# Altium project BT Mesh.PrjPcb
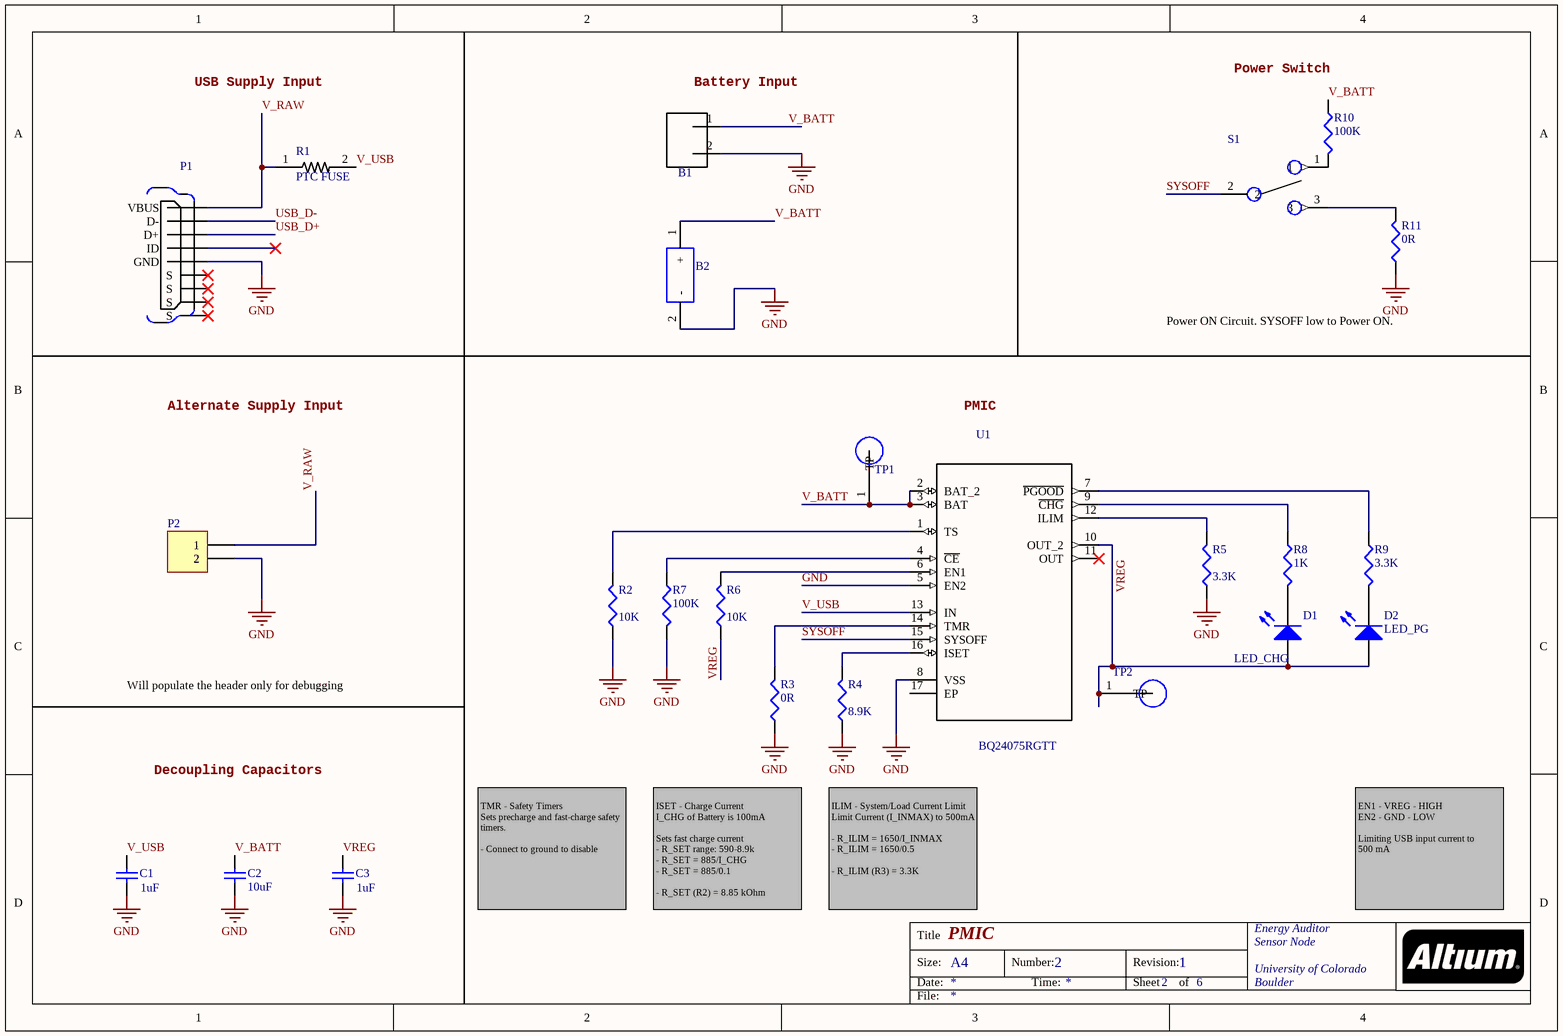
[diagram p0: PMIC.SchDoc]
6 sheets, 86 parts. Net scope: global (net labels, ports and power ports of the same name join across sheets).
Board file: BT Mesh.PcbDoc
Sheets:
  PMIC.SchDoc
  Regulator.SchDoc
  Gecko.SchDoc
  Gecko IO.SchDoc
  USB.SchDoc
  Block Diagram.SchDoc

## Sheet PMIC.SchDoc: PMIC
size A4; Organization: Energy Auditor; Address1: Sensor Node; Address3: University of Colorado; Address4: Boulder; DocumentNumber: 2; Revision: 1; SheetNumber: 2; SheetTotal: 6

### Parts
B1  S2B-PH-SM4-TB(LF)(SN)  [S2B-PH-SM4-TB(LF)(SN)]  (value not drawn)
B2  SMTU2450N-LF_BULK  [SMTU2430-LF]  (value not drawn)
C1  1uF  [1608[0603]]
C2  10uF  [1608[0603]]
C3  1uF  [1608[0603]]
D1  LED_CHG  [1608[0603]]
D2  LED_PG  [1608[0603]]
P1  10104111-0001LF  [FRAMATOME_10104111-0001LF]  (value not drawn)
P2  Header 2  [HDR1X2]  (value not drawn)
R1  PTC FUSE  [RESC3216X125N]
R2  10K  [1608[0603]]
R3  0R  [1608[0603]]
R4  8.9K  [1608[0603]]
R5  3.3K  [1608[0603]]
R6  10K  [1608[0603]]
R7  100K  [1608[0603]]
R8  1K  [1608[0603]]
R9  3.3K  [1608[0603]]
R10  100K  [1608[0603]]
R11  0R  [1608[0603]]
S1  AYZ0102AGRLC  [SW_AYZ0102AGRLC]  (value not drawn)
TP1  5019  [TP380X203]  (value not drawn)
TP2  5019  [TP380X203]  (value not drawn)
U1  BQ24075RGTT  [QFN50P300X300X100-17N]

### Nets
GND: B1.2 B2.2(-) C1.1 C2.1 C3.1 P1.5(GND) P2.2 R2.1 R3.1 R4.1 R5.1 R7.2 R11.1 U1.5(EN2) U1.8(VSS)
SYSOFF: S1.2 U1.15(SYSOFF)
USB_D+: P1.3(D+)
USB_D-: P1.2(D-)
V_BATT: B1.1 B2.1(+) C2.2 R10.1 TP1.1(TP) U1.2(BAT_2) U1.3(BAT)
V_RAW: P1.1(VBUS) P2.1 R1.1
V_USB: C1.2 R1.2 U1.13(IN)
VREG: C3.2 D1.1(A) D2.1(A) R6.1 TP2.1(TP) U1.10(OUT_2)
NetD1_2: D1.2(K) R8.2
NetD2_2: D2.2(K) R9.2
NetR2_2: R2.2 U1.1(TS)
NetR3_2: R3.2 U1.14(TMR)
NetR4_2: R4.2 U1.16(ISET)
NetR5_2: R5.2 U1.12(ILIM)
NetR6_2: R6.2 U1.6(EN1)
NetR7_1: R7.1 U1.4(~{CE})
NetR8_1: R8.1 U1.9(~{CHG})
NetR9_1: R9.1 U1.7(~{PGOOD})
NetR10_2: R10.2 S1.1
NetR11_2: R11.2 S1.3

Not connected (* = marked no-connect by the designer): P1 4(ID)* 6(S)* 7(S)* 8(S)* 9(S)*; U1 11(OUT)* 17(EP)

### Notes on the sheet
- USB Supply Input
- (near B1) Battery Input
- (near R10) Power Switch
- Power ON Circuit. SYSOFF low to Power ON.
- Alternate Supply Input
- PMIC
- Will populate the header only for debugging
- Decoupling Capacitors
- TMR - Safety Timers
  Sets precharge and fast-charge safety
  timers.
  - Connect to ground to disable
- ISET - Charge Current
  I_CHG of Battery is 100mA
  Sets fast charge current
  - R_SET range: 590-8.9k
  - R_SET = 885/I_CHG
  - R_SET = 885/0.1
  - R_SET (R2) = 8.85 kOhm
- ILIM - System/Load Current Limit
  Limit Current (I_INMAX) to 500mA
  - R_ILIM = 1650/I_INMAX
  - R_ILIM = 1650/0.5
  - R_ILIM (R3) = 3.3K
- EN1 - VREG - HIGH
  EN2 - GND - LOW
  Limiting USB input current to
  500 mA
- Title
- Size:
- Date:
- A4
- Number:
- Time:
- Revision:
- Sheet
- of
- File:

### Library data of the parts
B1 = S2B-PH-SM4-TB(LF)(SN): PH Series 2 Position 2 mm Pitch Surface Mount Side Entry Shrouded Header; Manufacturer: JST Sales America Inc.; Manufacturer Part Number: S2B-PH-SM4-TB(LF)(SN); Value: *; Digi-Key Part Number: 455-1749-1-ND; ComponentLInk1URL: https://www.digikey.com/products/en/connectors-interconnects/rectangular-connectors-headers-male-pins/314?k=S2B-PH-SM4-TB&k=&pkeyword=S2B-PH-SM4-TB&pv7=2&sf=0&quantity=&ColumnSort=0&page=1&pageSize=25; ComponentLink1Description: Digi-Key Link
B2 = SMTU2450N-LF_BULK: Coin Cell Battery Holders SFC MNT FOR CR2450N; Manufacturer: RENATA; Manufacturer Part Number: SMTU2450N-LF BULK; Mouser Part Number: 614-SMTU2450N-LF; ComponentLink1URL: https://www.mouser.com/ProductDetail/Renata/SMTU2450N-LF-BULK?qs=LsPilcdHE7Gn4SDnejz9jQ%3D%3D; ComponentLink1Description: Mouser Link
C1 C3 = Cap: CAP CER 1UF 16V X7R 0603; Manufacturer: Samsung Electro-Mechanics; Manufacturer Part Number: CL10B105MO8NNWC; Value: 1uF; Digi-Key Part Number: 1276-6524-1-ND; ComponentLink1URL: https://www.digikey.com/product-detail/en/samsung-electro-mechanics/CL10B105MO8NNWC/1276-6524-1-ND/5961383; ComponentLink1Description: Digi-Key Link
C2 = Cap Semi: CAP CER 10UF 10V X5R 0603; Manufacturer: Murata Electronics North America; Manufacturer Part Number: GRM188R61A106KE69D; Value: 10uF; Digi-Key Part Number: 490-10474-1-ND; ComponentLink1URL: https://www.digikey.com/products/en?keywords=490-10474-1-ND; ComponentLink1Description: Digi-Key Link
D1 = LED2: Blue 470nm LED Indication - Discrete 2.85V 0603 (1608 Metric); Manufacturer: OSRAM Opto Semiconductors Inc.; Manufacturer Part Number: LB Q39G-L2OO-35-1; Digi-Key Part Number: 475-2816-1-ND; ComponentLink1URL: https://www.digikey.com/product-detail/en/osram-opto-semiconductors-inc/LB-Q39G-L2OO-35-1/475-2816-1-ND/2176355; ComponentLink1Description: Digi-Key Link
D2 = LED2: LED GREEN DIFFUSED 0603 SMD; Manufacturer: OSRAM Opto Semiconductors Inc.; Manufacturer Part Number: LG L29K-F2J1-24-Z; Digi-Key Part Number: 475-3118-1-ND; ComponentLink1URL: https://www.digikey.com/product-detail/en/osram-opto-semiconductors-inc/LG-L29K-F2J1-24-Z/475-3118-1-ND/4899549; ComponentLink1Description: Digi-Key Link
P1 = 10104111-0001LF: Micro Usb, 2.0 Type Ab, Receptacle, Th; Manufacturer: Amphenol FCI; Digi-Key Part Number: 609-4053-1-ND; ComponentLink1URL: https://www.digikey.com/product-detail/en/amphenol-fci/10104111-0001LF/609-4053-1-ND/2350359?utm_source=snapeda&utm_medium=aggregator&utm_campaign=symbol; Manufacturer Part Number: 10104111-0001LF; Value: *; ComponentLink1Description: Digi-Key Link
P2 = Header 2: Header, 2-Pin
R1 = 0ZCA0075FF2G: PTC RESET FUSE 6V 500MA 1206; Manufacturer: Bel Fuse; Manufacturer Part Number: Littelfuse Inc.; Value: *; Digi-Key Part Number: F2112CT-ND; ComponentLink1URL: https://www.digikey.com/product-detail/en/littelfuse-inc/1206L050YR/F2112CT-ND/455721; ComponentLink1Description: Digi-Key Link
R2 R6 = Res3: RES SMD 10K OHM 1% 1/8W 0603; Manufacturer: Vishay Beyschlag; Manufacturer Part Number: MCT06030C1002FP500; Value: 10K; Digi-Key Part Number: MCT0603-10.0K-CFCT-ND; ComponentLink1URL: https://www.digikey.com/products/en?keywords=MCT0603-10.0K-CFCT-ND; ComponentLink1Description: Digi-Key Link
R3 R11 = Res3: RES 0 OHM JUMPER 1/8W 0603; Manufacturer: Vishay Beyschlag; Manufacturer Part Number: MCT0603MZ0000ZP500; Value: 0R; Digi-Key Part Number: 749-1745-1-ND; ComponentLink1URL: https://www.digikey.com/product-detail/en/vishay-beyschlag/MCT0603MZ0000ZP500/749-1745-1-ND/7348053; ComponentLink1Description: Digi-Key Link
R4 = Res3: RES SMD 8.87KOHM 0.5% 1/10W 0603; Manufacturer: Yageo; Manufacturer Part Number: RT0603DRD078K87L; Value: 8.9K; Digi-Key Part Number: 311-8.87KDCT-ND; ComponentLink1URL: https://www.digikey.com/product-detail/en/yageo/RT0603DRD078K87L/311-8.87KDCT-ND/1035893; ComponentLink1Description: Digi-Key Link
R5 R9 = Res3: RES SMD 3.3K OHM 5% 1/10W 0603; Manufacturer: Panasonic Electronic Components; Manufacturer Part Number: ERJ-3GEYJ332V; Value: 3.3K; Digi-Key Part Number: P3.3KGCT-ND; ComponentLink1URL: https://www.digikey.com/product-detail/en/panasonic-electronic-components/ERJ-3GEYJ332V/P3.3KGCT-ND/135146; ComponentLink1Description: Digi-Key Link
R7 R10 = Res3: RES SMD 100K OHM 0.1% 1/10W 0603; Manufacturer: Susumu; Manufacturer Part Number: RG1608P-104-B-T5; Value: 100K; Digi-Key Part Number: RG16P100KBCT-ND; ComponentLink1URL: https://www.digikey.com/products/en/resistors/chip-resistor-surface-mount/52?k=RG1608P-104-B-T5&k=&pkeyword=RG1608P-104-B-T5&pv7=2&sf=0&quantity=&ColumnSort=0&page=1&pageSize=25; ComponentLink1Description: Digi-Key Link
R8 = Res3: RES SMD 1K OHM 0.1% 1/10W 0603; Manufacturer: Yageo; Manufacturer Part Number: RT0603BRD071KL; Value: 1K; Digi-Key Part Number: YAG1237CT-ND; ComponentLink1URL: https://www.digikey.com/product-detail/en/yageo/RT0603BRD071KL/YAG1237CT-ND/4340590; ComponentLink1Description: Digi-Key Link
S1 = AYZ0102AGRLC: SWITCH SLIDE SPDT 100MA 12V; Manufacturer: C&K; Digi-Key Part Number: 401-2012-1-ND; Manufacturer Part Number: AYZ0102AGRLC; ComponentLink1URL: https://www.digikey.com/products/en/switches/slide-switches/213?k=AYZ0102AGRLC&k=&pkeyword=AYZ0102AGRLC&pv7=2&sf=0&quantity=&ColumnSort=0&page=1&pageSize=25; ComponentLink1Description: Digi-Key Link
TP1 TP2 = 5019: Phosphor Bronze Contact Miniature Silver Plated Surface Mount Test Points; Manufacturer: Keystone; Manufacturer Part Number: 5019; Digi-Key Part Number: 36-5019CT-ND; ComponentLink1URL: https://www.digikey.com/product-detail/en/keystone-electronics/5019/36-5019CT-ND/3907344?utm_source=snapeda&utm_medium=aggregator&utm_campaign=symbol; Value: *; ComponentLink1Description: Digi-Key Link
U1 = BQ24075RGTT: USB-Friendly Li-Ion Battery Charger and Power-Path Management IC, Vout 5.5V 16-QFN -40 to 85; Manufacturer: Texas Instruments; Manfacturer Part Number: BQ24075RGTT; Availability: Unavailable; Value: *; Digi-Key Part Number: 296-38874-1-ND; ComponentLink1Description: Digi-Key Link; ComponentLink1URL: https://www.digikey.com/products/en/integrated-circuits-ics/pmic-battery-chargers/781?k=BQ24075RGTR&k=&pkeyword=BQ24075RGTR&pv7=2&sf=0&quantity=&ColumnSort=0&page=1&pageSize=25

## Sheet Regulator.SchDoc: Regulator
size A4; Organization: Energy Auditor; Address1: Sensor Node; Address3: University of Colorado; Address4: Boulder; DocumentNumber: 3; Revision: 1; SheetNumber: 3; SheetTotal: 6
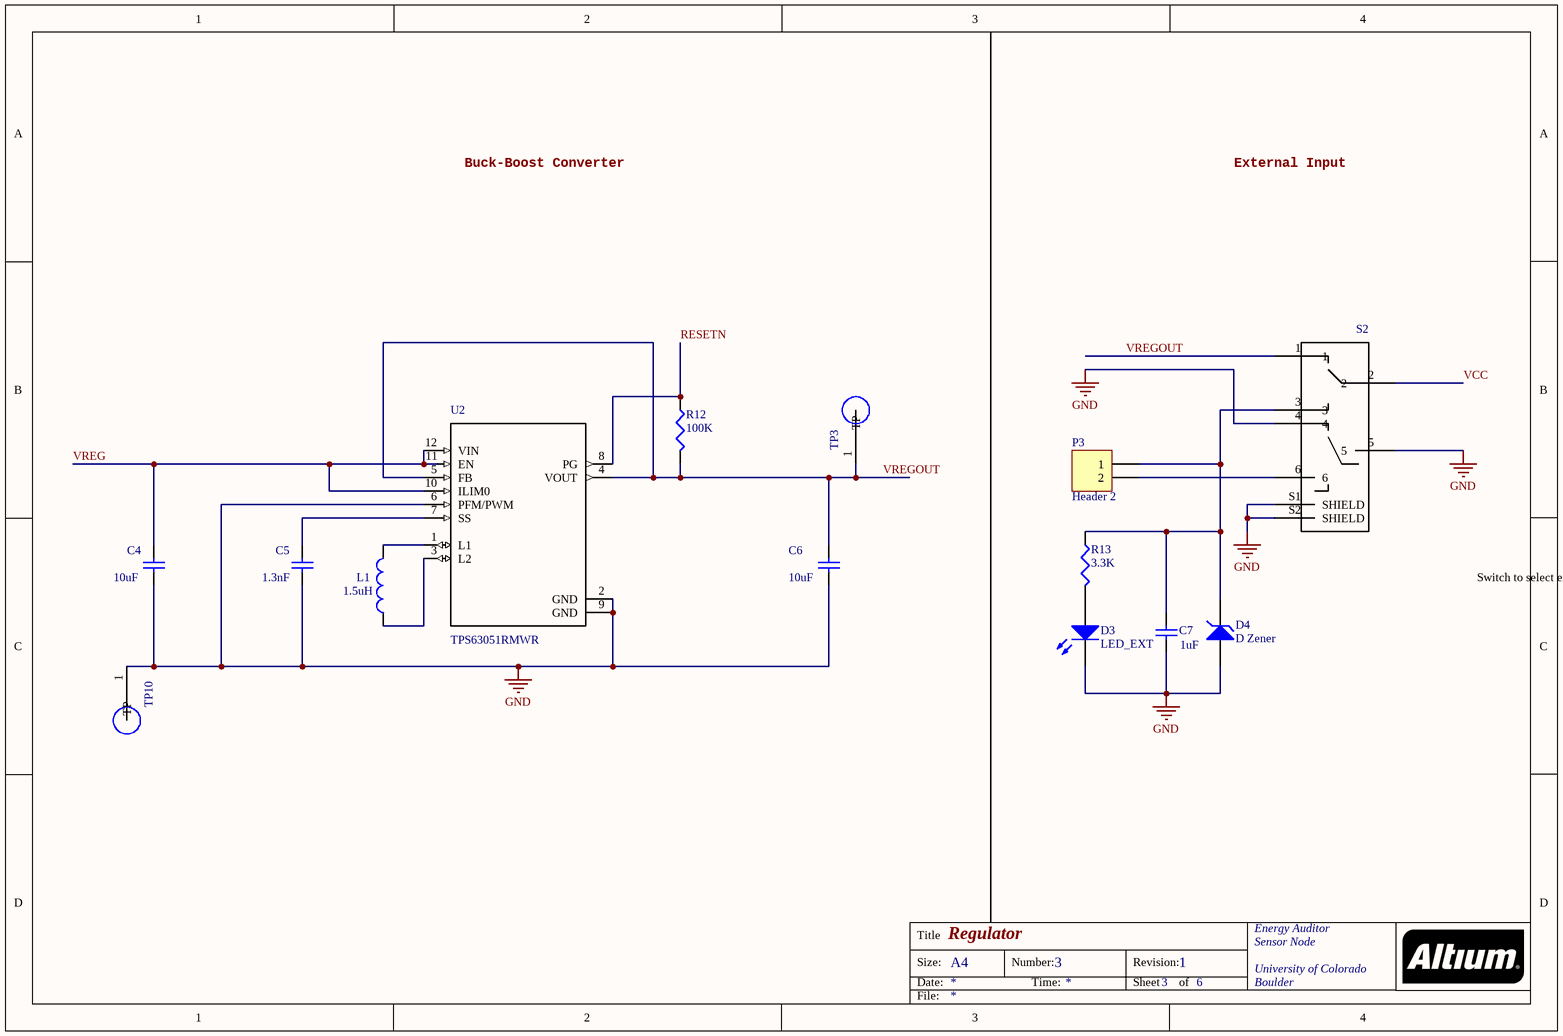
[diagram p1: Regulator.SchDoc]

### Parts
C4  10uF  [1608[0603]]
C5  1.3nF  [1608[0603]]
C6  10uF  [1608[0603]]
C7  1uF  [1608[0603]]
D3  LED_EXT  [3.2X1.6X1.1]
D4  D Zener  [0402]
L1  1.5uH  [0603]
P3  Header 2  [HDR1X2]
R12  100K  [1608[0603]]
R13  3.3K  [1608[0603]]
S2  1825289-1  [SW_1825289-1_1825289-1(Primary)]  (value not drawn)
TP3  5019  [TP380X203]  (value not drawn)
TP10  5019  [TP380X203]  (value not drawn)
U2  TPS63051RMWR  [QFN50P250X250X100-12N]

### Nets
GND: C4.1 C5.1 C6.1 C7.1 D3.2(K) D4.1(A) S2.4 S2.5 S2.S1(SHIELD) S2.S2(SHIELD) TP10.1(TP) U2.2(GND) U2.6(PFM/PWM) U2.9(GND)
RESETN: R12.1 U2.8(PG)
VCC: S2.2
VREG: C4.2 U2.10(ILIM0) U2.11(EN) U2.12(VIN)
VREGOUT: C6.2 R12.2 S2.1 TP3.1(TP) U2.4(VOUT) U2.5(FB)
NetC5_2: C5.2 U2.7(SS)
NetC7_2: C7.2 D4.2(K) P3.1 R13.2 S2.3
NetD3_1: D3.1(A) R13.1
NetL1_1: L1.1 U2.3(L2)
NetL1_2: L1.2 U2.1(L1)
NetP3_2: P3.2 S2.6

### Notes on the sheet
- Buck-Boost Converter
- External Input
- Switch to select external supply
- Title
- Size:
- Date:
- A4
- Number:
- Time:
- Revision:
- Sheet
- of
- File:

### Library data of the parts
C4 C6 = Cap: CAP CER 10UF 10V X5R 0603; Manufacturer: Murata Electronics North America; Manufacturer Part Number: GRM188R61A106KE69D; Value: 10uF; ComponentLink1URL: https://www.digikey.com/products/en?keywords=490-10474-1-ND; ComponentLink1Description: Digi-Key Link; Digi-Key Part Number: 490-10474-1-ND
C5 = Cap: CAP CER 1300PF 25V C0G/NP0 0603; Manufacturer: KEMET; Manufacturer Part Number: C0603C132J3GAC7867; Value: 1.3nF; ComponentLink1URL: https://www.digikey.com/product-detail/en/kemet/C0603C132J3GAC7867/399-14953-1-ND/7382502; ComponentLink1Description: Digi-Key Link; Digi-Key Part Number: 399-14953-1-ND
C7 = Cap: as C1 on sheet PMIC; Value: 1uF; Digi-Key Part Number: 1276-6524-1-ND; ComponentLink1URL: https://www.digikey.com/product-detail/en/samsung-electro-mechanics/CL10B105MO8NNWC/1276-6524-1-ND/5961383; ComponentLink1Description: Digi-Key Link
D3 = LED2: as D2 on sheet PMIC; Digi-Key Part Number: 475-3118-1-ND; ComponentLink1URL: https://www.digikey.com/product-detail/en/osram-opto-semiconductors-inc/LG-L29K-F2J1-24-Z/475-3118-1-ND/4899549; ComponentLink1Description: Digi-Key Link
D4 = D Zener: TVS DIODE 5.5V 14V 2X1SON; Manufacturer Part Number: TPD1E10B06DPYR; Manufacturer: Texas Instruments; ComponentLink1URL: https://www.digikey.com/product-detail/en/texas-instruments/TPD1E10B06DPYR/296-30406-1-ND/3283560; ComponentLink1Description: Digi-Key Link; Value: *; Digi-Key Part Number: 296-30406-1-ND
L1 = Inductor: FIXED IND 1.5UH 1.1A 213 MOHM; Manufacturer: Murata Electronics North America; Manufacturer Part Number: LQM18PN1R5MFHD; Value: 1.5uH; Digi-Key Part Number: 490-15637-1-ND; ComponentLink1URL: https://www.digikey.com/product-detail/en/murata-electronics-north-america/LQM18PN1R5MFHD/490-15637-1-ND/6800302; ComponentLink1Description: Digi-Key Link
P3 = Header 2: Header, 2-Pin
R12 = Res3: as R7 on sheet PMIC; Value: 100K; Digi-Key Part Number: RG16P100KBCT-ND; ComponentLink1URL: https://www.digikey.com/products/en/resistors/chip-resistor-surface-mount/52?k=RG1608P-104-B-T5&k=&pkeyword=RG1608P-104-B-T5&pv7=2&sf=0&quantity=&ColumnSort=0&page=1&pageSize=25; ComponentLink1Description: Digi-Key Link
R13 = Res3: as R5 on sheet PMIC; Value: 3.3K; Digi-Key Part Number: P3.3KGCT-ND; ComponentLink1URL: https://www.digikey.com/product-detail/en/panasonic-electronic-components/ERJ-3GEYJ332V/P3.3KGCT-ND/135146; ComponentLink1Description: Digi-Key Link
S2 = 1825289-1: MHS22204=DPDT SL SW VERT AG; Manufacturer: TE Connectivity; Manufacturer Part Number: 1825289-1; ComponentLink1URL: https://www.digikey.com/products/en?keywords=MHS22204; ComponentLink1Description: Digi-Key Link; Digi-Key Part Number: 450-1572-ND
TP3 TP10 = 5019: as TP1 on sheet PMIC; Manufacturer Part Number: 5019; Digi-Key Part Number: 36-5019CT-ND; ComponentLink1URL: https://www.digikey.com/product-detail/en/keystone-electronics/5019/36-5019CT-ND/3907344?utm_source=snapeda&utm_medium=aggregator&utm_campaign=symbol; Value: *; ComponentLink1Description: Digi-Key Link
U2 = TPS63051RMWR: Tiny Single Inductor Buck Boost Converter 12-VQFN -40 to 85; Manufacturer: Texas Instruments; Manufacturer Part Number: TPS63051RMWR; Value: *; Digi-Key Part Number: 296-42650-1-ND; ComponentLink1URL: https://www.digikey.com/products/en/integrated-circuits-ics/pmic-voltage-regulators-dc-dc-switching-regulators/739?k=TPS63051RMWR&k=&pkeyword=TPS63051RMWR&pv7=2&sf=0&quantity=&ColumnSort=0&page=1&pageSize=25; ComponentLink1Description: Digi-Key Link

## Sheet Gecko.SchDoc: Blue Gecko and Sensor
size A4; Organization: Energy Auditor; Address1: Sensor Node; Address3: University of Colorado; Address4: Boulder; DocumentNumber: 4; Revision: 1; SheetNumber: 4; SheetTotal: 6
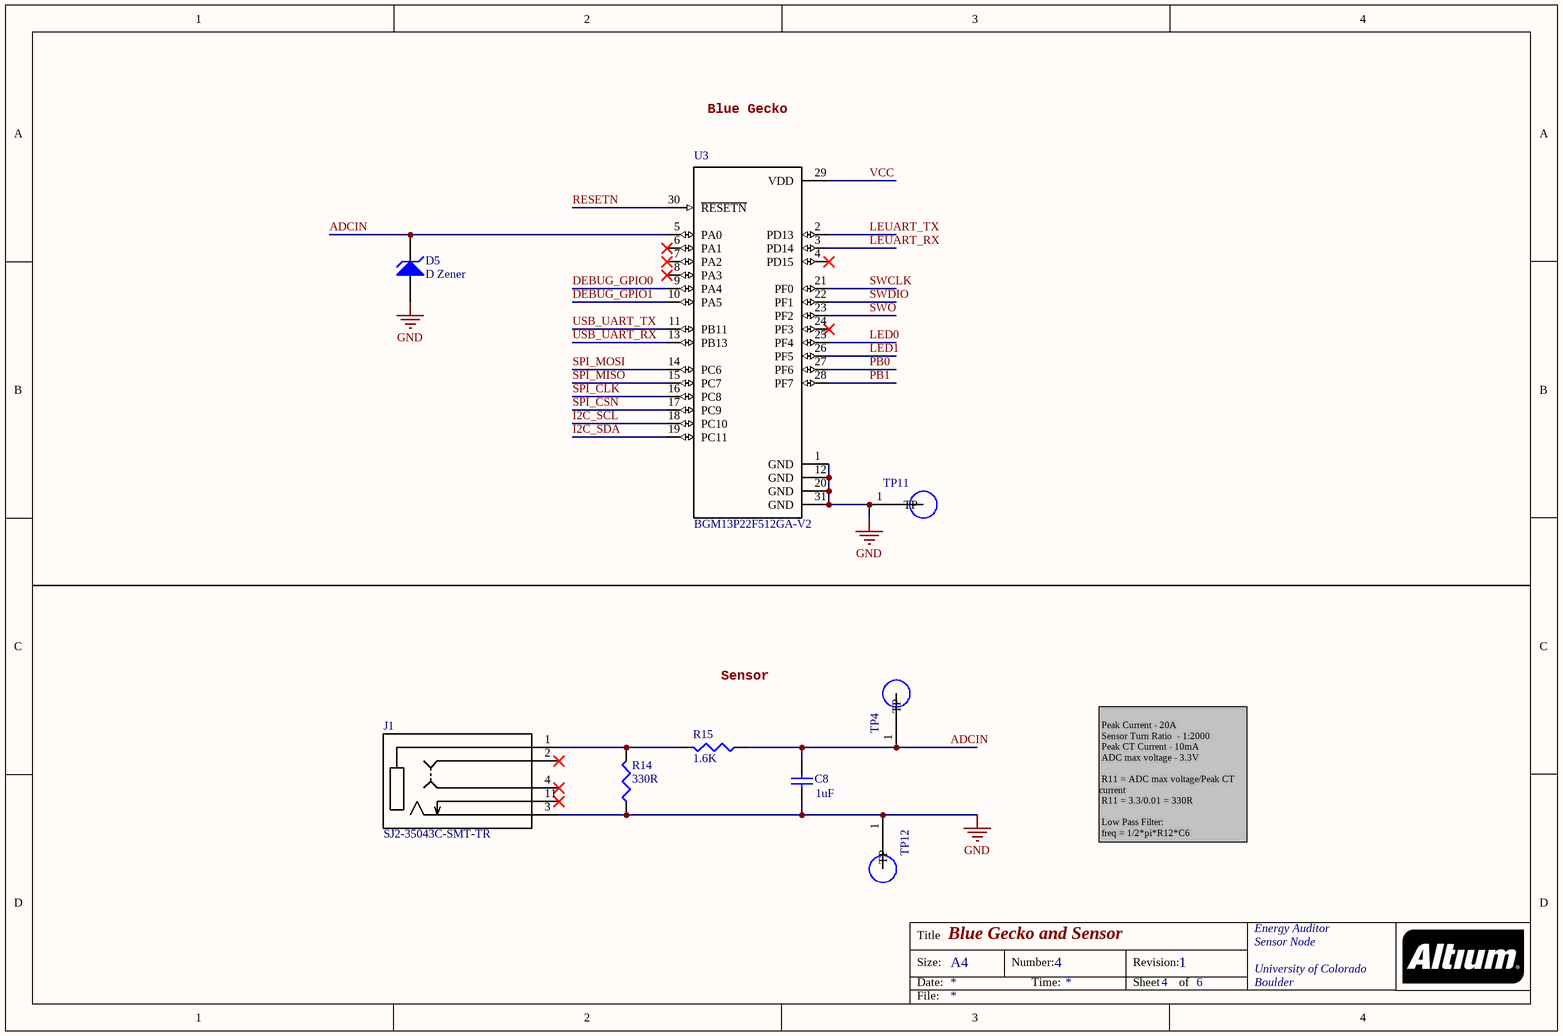
[diagram p2: Gecko.SchDoc]

### Parts
C8  1uF  [1608[0603]]
D5  D Zener  [0402]
J1  SJ2-35043C-SMT-TR  [CUI_SJ2-35043C-SMT-TR]
R14  value 330R  [1608[0603]]  (hidden comment: 330)
R15  1.6K  [1608[0603]]
TP4  5019  [TP380X203]  (value not drawn)
TP11  5019  [TP380X203]  (value not drawn)
TP12  5019  [TP380X203]  (value not drawn)
U3  BGM13P22F512GA-V2  [MODULE_BGM13P22F512GA-V2]

### Nets
GND: C8.1 D5.1(A) J1.3(RING) R14.1 TP11.1(TP) TP12.1(TP) U3.1(GND) U3.12(GND) U3.20(GND) U3.31(GND)
ADCIN: C8.2 D5.2(K) R15.1 TP4.1(TP) U3.5(PA0)
DEBUG_GPIO0: U3.9(PA4)
DEBUG_GPIO1: U3.10(PA5)
I2C_SCL: U3.18(PC10)
I2C_SDA: U3.19(PC11)
LED0: U3.25(PF4)
LED1: U3.26(PF5)
LEUART_RX: U3.3(PD14)
LEUART_TX: U3.2(PD13)
PB0: U3.27(PF6)
PB1: U3.28(PF7)
RESETN: U3.30(~{RESETN})
SPI_CLK: U3.16(PC8)
SPI_CSN: U3.17(PC9)
SPI_MISO: U3.15(PC7)
SPI_MOSI: U3.14(PC6)
SWCLK: U3.21(PF0)
SWDIO: U3.22(PF1)
SWO: U3.23(PF2)
USB_UART_RX: U3.13(PB13)
USB_UART_TX: U3.11(PB11)
VCC: U3.29(VDD)
NetJ1_1: J1.1(SLEEVE) R14.2 R15.2

Not connected (* = marked no-connect by the designer): J1 2(TIP_1)* 4(TIP_2)* 11(RING_SWITCH)*; U3 4(PD15)* 6(PA1)* 7(PA2)* 8(PA3)* 24(PF3)*

### Notes on the sheet
- Blue Gecko
- Sensor
- Peak Current - 20A
  Sensor Turn Ratio  - 1:2000
  Peak CT Current - 10mA
  ADC max voltage - 3.3V
  R11 = ADC max voltage/Peak CT current
  R11 = 3.3/0.01 = 330R
  Low Pass Filter:
  freq = 1/2*pi*R12*C6
  freq = 312 Hz
- Title
- Size:
- Date:
- A4
- Number:
- Time:
- Revision:
- Sheet
- of
- File:

### Library data of the parts
C8 = Cap: as C1 on sheet PMIC; Value: 1uF; Digi-Key Part Number: 1276-6524-1-ND; ComponentLink1URL: https://www.digikey.com/product-detail/en/samsung-electro-mechanics/CL10B105MO8NNWC/1276-6524-1-ND/5961383; ComponentLink1Description: Digi-Key Link
D5 = D Zener: Zener Diode; Manufacturer Part Number: TPD1E10B06DPYR; Manufacturer: Texas Instruments; ComponentLink1URL: https://www.digikey.com/product-detail/en/texas-instruments/TPD1E10B06DPYR/296-30406-1-ND/3283560; ComponentLink1Description: Digi-Key Link; Value: *; Digi-Key Part Number: 296-30406-1-ND
J1 = SJ2-35043C-SMT-TR: AUDIO JACK, 3.5 MM, RT, 4 CONDUC; Manufacturer: CUI Inc.; Value: *; Digi-Key Part Number: CP-SJ2-35043C-SMT-CT-ND; Manufacturer Part Number: SJ2-35043C-SMT-TR; ComponentLink1URL: https://www.digikey.com/products/en/connectors-interconnects/barrel-audio-connectors/434?k=SJ2-35043C-SMT-TR&k=&pkeyword=SJ2-35043C-SMT-TR&pv7=2&sf=0&quantity=&ColumnSort=0&page=1&pageSize=25; ComponentLink1Description: Digi-Key Link
R14 = Res3: RES SMD 330 OHM 5% 1/10W 0603; Manufacturer: Vishay Dale; Manufacturer Part Number: CRCW0603330RJNEAC; Digi-Key Part Number: 541-4060-1-ND; ComponentLink1URL: https://www.digikey.com/product-detail/en/vishay-dale/CRCW0603330RJNEAC/541-4060-1-ND/7928743; ComponentLink1Description: Digi-Key Link
R15 = Res3: RES SMD 1.6K OHM 5% 1/10W 0603; Manufacturer: Yageo; Manufacturer Part Number: RC0603JR-071K6L; Value: 1.6K; Digi-Key Part Number: 311-1.6KGRCT-ND; ComponentLink1URL: https://www.digikey.com/product-detail/en/yageo/RC0603JR-071K6L/311-1.6KGRCT-ND/729639; ComponentLink1Description: Digi-Key Link
TP4 TP11 TP12 = 5019: as TP1 on sheet PMIC; Manufacturer Part Number: 5019; Digi-Key Part Number: 36-5019CT-ND; ComponentLink1URL: https://www.digikey.com/product-detail/en/keystone-electronics/5019/36-5019CT-ND/3907344?utm_source=snapeda&utm_medium=aggregator&utm_campaign=symbol; Value: *; ComponentLink1Description: Digi-Key Link
U3 = BGM13P22F512GA-V2: BLUETOOTH 5.0 MODULE; Manufacturer: Silicon Labs; Manufacturer Part Number: BGM13P22F512GA-V2; Value: *; ComponentLink1URL: https://www.digikey.com/products/en/rf-if-and-rfid/rf-transceiver-modules/872?k=BGM13P22F512GA-V2&k=&pkeyword=BGM13P22F512GA-V2&pv7=2&sf=0&quantity=&ColumnSort=0&page=1&pageSize=25; ComponentLink1Description: Digi-Key Link; Digi-Key Part Number: 336-5146-1-ND

## Sheet Gecko IO.SchDoc: Gecko IO
size A4; Organization: Energy Auditor; Address1: Sensor Node; Address3: University of Colorado; Address4: Boulder; DocumentNumber: 5; Revision: 1; SheetNumber: 5; SheetTotal: 6
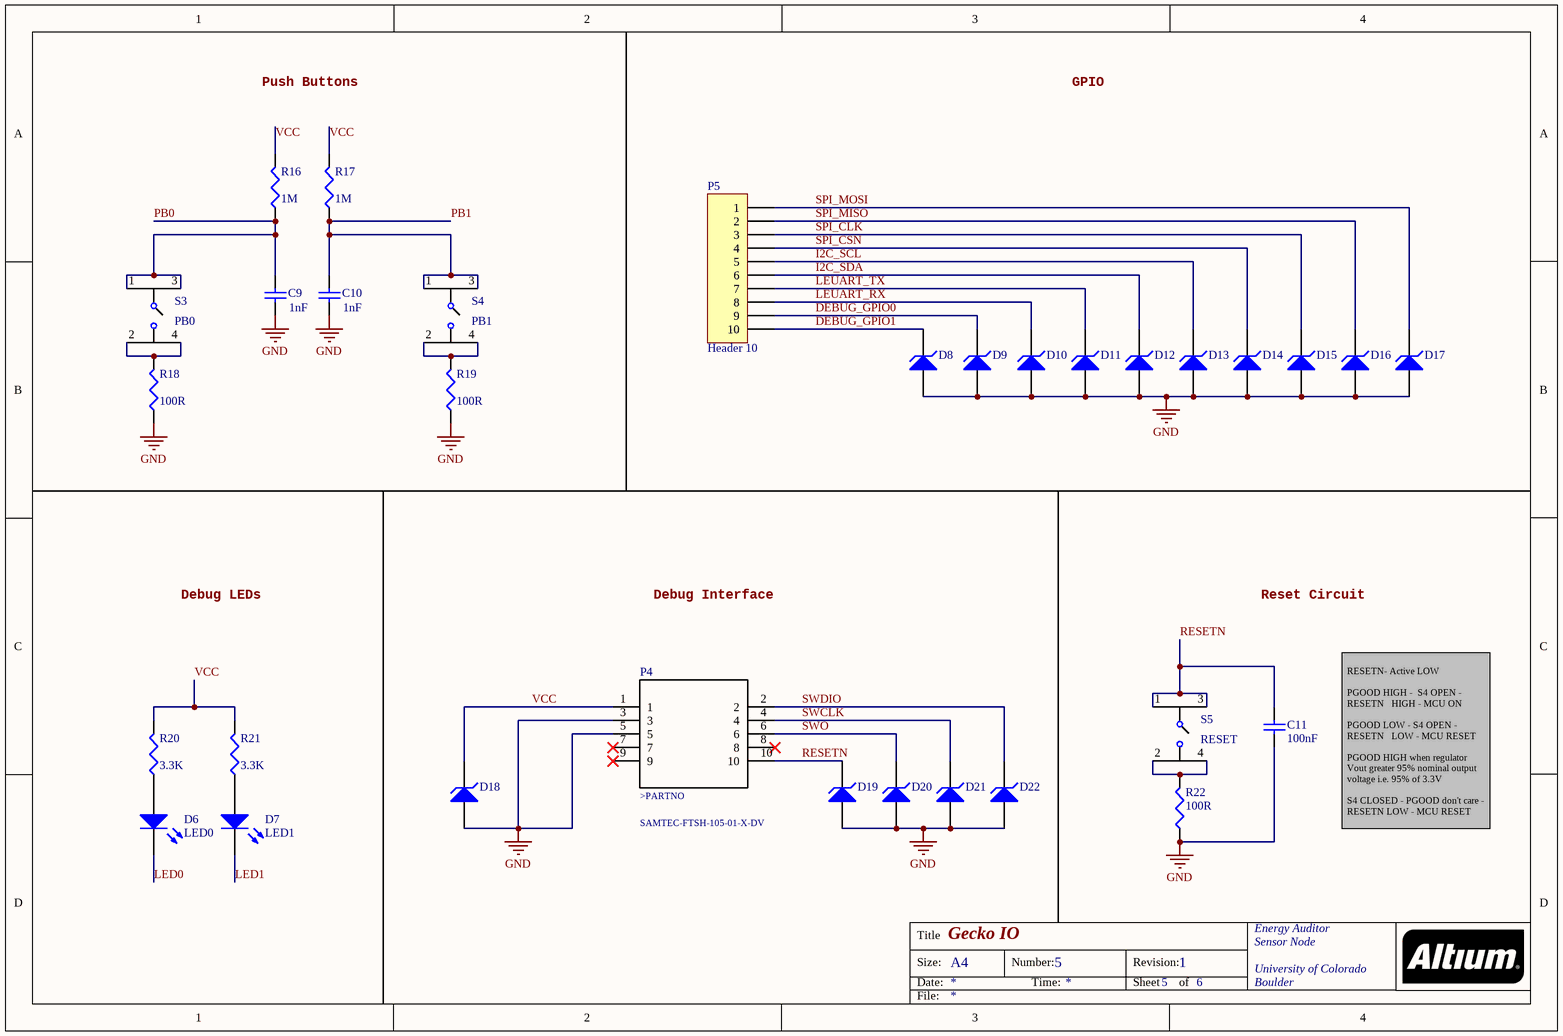
[diagram p3: Gecko IO.SchDoc]

### Parts
C9  1nF  [1608[0603]]
C10  1nF  [1608[0603]]
C11  100nF  [1608[0603]]
D6  LED0  [3.2X1.6X1.1]
D7  LED1  [3.2X1.6X1.1]
D8  D Zener  [0402]  (value not drawn)
D9  D Zener  [0402]  (value not drawn)
D10  D Zener  [0402]  (value not drawn)
D11  D Zener  [0402]  (value not drawn)
D12  D Zener  [0402]  (value not drawn)
D13  D Zener  [0402]  (value not drawn)
D14  D Zener  [0402]  (value not drawn)
D15  D Zener  [0402]  (value not drawn)
D16  D Zener  [0402]  (value not drawn)
D17  D Zener  [0402]  (value not drawn)
D18  D Zener  [0402]  (value not drawn)
D19  D Zener  [0402]  (value not drawn)
D20  D Zener  [0402]  (value not drawn)
D21  D Zener  [0402]  (value not drawn)
D22  D Zener  [0402]  (value not drawn)
P4  SAMTEC-FTSH-105-01-X-DV  [SAMTEC-FTSH-105-01-X-DV]  (value not drawn)
P5  Header 10  [HDR1X10]
R16  1M  [1608[0603]]
R17  1M  [1608[0603]]
R18  100R  [1608[0603]]
R19  100R  [1608[0603]]
R20  3.3K  [1608[0603]]
R21  3.3K  [1608[0603]]
R22  100R  [1608[0603]]
S3  PB0  [430182043816]
S4  PB1  [430182043816]
S5  RESET  [430182043816]

### Nets
GND: C9.1 C10.1 C11.2 D8.1(A) D9.1(A) D10.1(A) D11.1(A) D12.1(A) D13.1(A) D14.1(A) D15.1(A) D16.1(A) D17.1(A) D18.1(A) D19.1(A) D20.1(A) D21.1(A) D22.1(A) P4.3 P4.5 R18.1 R19.1 R22.1
DEBUG_GPIO0: D9.2(K) P5.9
DEBUG_GPIO1: D8.2(K) P5.10
I2C_SCL: D13.2(K) P5.5
I2C_SDA: D12.2(K) P5.6
LED0: D6.2(K)
LED1: D7.2(K)
LEUART_RX: D10.2(K) P5.8
LEUART_TX: D11.2(K) P5.7
PB0: C9.2 R16.1 S3.1 S3.3
PB1: C10.2 R17.1 S4.1 S4.3
RESETN: C11.1 D19.2(K) P4.10 S5.1 S5.3
SPI_CLK: D15.2(K) P5.3
SPI_CSN: D14.2(K) P5.4
SPI_MISO: D16.2(K) P5.2
SPI_MOSI: D17.2(K) P5.1
SWCLK: D21.2(K) P4.4
SWDIO: D22.2(K) P4.2
SWO: D20.2(K) P4.6
VCC: D18.2(K) P4.1 R16.2 R17.2 R20.2 R21.2
NetD6_1: D6.1(A) R20.1
NetD7_1: D7.1(A) R21.1
NetR18_2: R18.2 S3.2 S3.4
NetR19_2: R19.2 S4.2 S4.4
NetR22_2: R22.2 S5.2 S5.4

Not connected (* = marked no-connect by the designer): P4 7* 8* 9*

### Notes on the sheet
- Push Buttons
- GPIO
- Debug LEDs
- Debug Interface
- Reset Circuit
- RESETN- Active LOW
  PGOOD HIGH -  S4 OPEN -
  RESETN   HIGH - MCU ON
  PGOOD LOW - S4 OPEN -
  RESETN   LOW - MCU RESET
  PGOOD HIGH when regulator
  Vout greater 95% nominal output
  voltage i.e. 95% of 3.3V
  S4 CLOSED - PGOOD don't care -
  RESETN LOW - MCU RESET
- Title
- Size:
- Date:
- A4
- Number:
- Time:
- Revision:
- Sheet
- of
- File:
- (in symbol SAMTEC-FTSH-105-01-X-DV) >PARTNO

### Library data of the parts
C9 C10 = Cap: CAP CER 1000PF 50V X7R 0603; Manufacturer: AVX Corporation; Manufacturer Part Number: 06035C102JAT2A; Value: 1nF; Digi-Key Part Number: 478-5006-1-ND; ComponentLink1Description: Digi-Key Link; ComponentLink1URL: https://www.digikey.com/product-detail/en/avx-corporation/06035C102JAT2A/478-5006-1-ND/1888217
C11 = Cap: CAP CER 0.1UF 16V X7R 0603; Manufacturer: AVX Corporation; Manufacturer Part Number: 0603YC104MAT4A; Value: 100nF; Digi-Key Part Number: 478-7617-1-ND; ComponentLink1Description: Digi-Key Link; ComponentLink1URL: https://www.digikey.com/products/en/capacitors/ceramic-capacitors/60?k=capacitor&k=&pkeyword=capacitor&pv2049=u0.1%C2%B5F&sf=0&FV=c0005%2C1c0002%2C380009%2C400005%2C1f140000%2Cffe0003c&quantity=&ColumnSort=0&page=1&stock=1&pageSize=25
D6 D7 = LED2: as D2 on sheet PMIC; Digi-Key Part Number: 475-3118-1-ND; ComponentLink1URL: https://www.digikey.com/product-detail/en/osram-opto-semiconductors-inc/LG-L29K-F2J1-24-Z/475-3118-1-ND/4899549; ComponentLink1Description: Digi-Key Link
D8-D22 = D Zener: as D4 on sheet Regulator; ComponentLink1URL: https://www.digikey.com/product-detail/en/texas-instruments/TPD1E10B06DPYR/296-30406-1-ND/3283560; ComponentLink1Description: Digi-Key Link; Value: *; Digi-Key Part Number: 296-30406-1-ND
P4 = SAMTEC-FTSH-105-01-X-DV: .050" X .050 TERMINAL STRIP; Manufacturer: Samtec; Manufacturer Part Number: FTSH-105-01-F-DV-K-TR; Value: *; Digi-Key Part Number: SAM13160CT-ND; ComponentLink1URL: https://www.digikey.com/products/en/connectors-interconnects/rectangular-connectors-headers-male-pins/314?k=FTSH-105-01-F-DV-K-TR&k=&pkeyword=FTSH-105-01-F-DV-K-TR&pv7=2&sf=0&quantity=&ColumnSort=0&page=1&pageSize=25; ComponentLink1Description: Digi-Key Link
P5 = Header 10: Header, 10-Pin
R16 R17 = Res3: RES SMD 1M OHM 5% 1/10W 0603; Manufacturer: Samsung Electro-Mechanics; Manufacturer Part Number: RC1608J105CS; Value: 1M; Digi-Key Part Number: 1276-5134-1-ND; ComponentLink1URL: https://www.digikey.com/product-detail/en/samsung-electro-mechanics/RC1608J105CS/1276-5134-1-ND/3968106; ComponentLink1Description: Digi-Key Link
R18 R19 R22 = Res3: RES SMD 100 OHM 5% 1/10W 0603; Manufacturer: Vishay Dale; Manufacturer Part Number: CRCW0603100RJNEAC; Value: 100R; Digi-Key Part Number: 541-4059-1-ND; ComponentLink1URL: https://www.digikey.com/product-detail/en/vishay-dale/CRCW0603100RJNEAC/541-4059-1-ND/7928742; ComponentLink1Description: Digi-Key Link
R20 R21 = Res3: as R5 on sheet PMIC; Value: 3.3K; Digi-Key Part Number: P3.3KGCT-ND; ComponentLink1URL: https://www.digikey.com/product-detail/en/panasonic-electronic-components/ERJ-3GEYJ332V/P3.3KGCT-ND/135146; ComponentLink1Description: Digi-Key Link
S3-S5 = 430182043816: SWITCH TACTILE SPST-NO 0.05A 12V; Manufacturer: Wurth Electronics; Manufacturer Part Number: 430182043816; Value: *; Digi-Key Part Number: 732-7004-1-ND; ComponentLink1URL: https://www.digikey.com/products/en/switches/tactile-switches/197?k=430+182+043+816&k=&pkeyword=430+182+043+816&pv7=2&sf=0&quantity=&ColumnSort=0&page=1&pageSize=25; ComponentLink1Description: Digi-Key Link

## Sheet USB.SchDoc: USB UART
size A4; Organization: Energy Auditor; Address1: Sensor Node; Address3: University of Colorado; Address4: Boulder; DocumentNumber: 6; Revision: 1; SheetNumber: 6; SheetTotal: 6
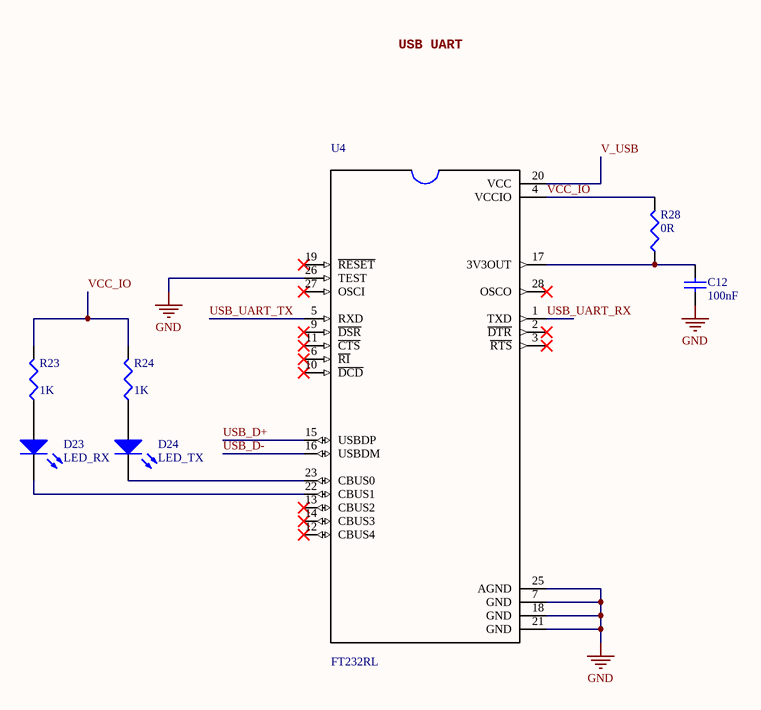
[diagram p4: USB.SchDoc]

### Parts
C12  100nF  [1608[0603]]
D23  LED_RX  [1608[0603]]
D24  LED_TX  [1608[0603]]
R23  1K  [1608[0603]]
R24  1K  [1608[0603]]
R28  0R  [1608[0603]]
U4  FT232RL  [SOP65P780X200-28N]

### Nets
GND: C12.2 U4.7(GND) U4.18(GND) U4.21(GND) U4.25(AGND) U4.26(TEST)
USB_D+: U4.15(USBDP)
USB_D-: U4.16(USBDM)
USB_UART_RX: U4.1(TXD)
USB_UART_TX: U4.5(RXD)
V_USB: U4.20(VCC)
VCC_IO: R23.2 R24.2 R28.2 U4.4(VCCIO)
NetC12_1: C12.1 R28.1 U4.17(3V3OUT)
NetD23_1: D23.1(A) R23.1
NetD23_2: D23.2(K) U4.22(CBUS1)
NetD24_1: D24.1(A) R24.1
NetD24_2: D24.2(K) U4.23(CBUS0)

Not connected (* = marked no-connect by the designer): U4 2(~{DTR})* 3(~{RTS})* 6(~{RI})* 9(~{DSR})* 10(~{DCD})* 11(~{CTS})* 12(CBUS4)* 13(CBUS2)* 14(CBUS3)* 19(~{RESET})* 27(OSCI)* 28(OSCO)*

### Notes on the sheet
- USB UART
- Title
- Size:
- Date:
- A4
- Number:
- Time:
- Revision:
- Sheet
- of
- File:

### Library data of the parts
C12 = Cap: as C11 on sheet Gecko IO; Value: 100nF; Digi-Key Part Number: 478-7617-1-ND; ComponentLink1Description: Digi-Key Link; ComponentLink1URL: https://www.digikey.com/products/en/capacitors/ceramic-capacitors/60?k=capacitor&k=&pkeyword=capacitor&pv2049=u0.1%C2%B5F&sf=0&FV=c0005%2C1c0002%2C380009%2C400005%2C1f140000%2Cffe0003c&quantity=&ColumnSort=0&page=1&stock=1&pageSize=25
D23 = LED2: LED RED DIFFUSED 0603 SMD; Manufacturer: OSRAM Opto Semiconductors Inc.; Manufacturer Part Number: LS L29K-H1J2-1-Z; Digi-Key Part Number: 475-1195-1-ND; ComponentLink1URL: https://www.digikey.com/product-detail/en/osram-opto-semiconductors-inc/LG-L29K-F2J1-24-Z/475-3118-1-ND/4899549; ComponentLink1Description: Digi-Key Link
D24 = LED2: LED YELLOW DIFFUSED 0603 SMD; Manufacturer: OSRAM Opto Semiconductors Inc.; Manufacturer Part Number: LY L29K-H1K2-26-Z; Digi-Key Part Number: 475-1196-1-ND; ComponentLink1URL: https://www.digikey.com/product-detail/en/osram-opto-semiconductors-inc/LY-L29K-H1K2-26-Z/475-1196-1-ND/810357; ComponentLink1Description: Digi-Key Link
R23 R24 = Res3: as R8 on sheet PMIC; Value: 1K; Digi-Key Part Number: YAG1237CT-ND; ComponentLink1URL: https://www.digikey.com/product-detail/en/yageo/RT0603BRD071KL/YAG1237CT-ND/4340590; ComponentLink1Description: Digi-Key Link
R28 = Res3: as R3 on sheet PMIC; Value: 0R; Digi-Key Part Number: 749-1745-1-ND; ComponentLink1URL: https://www.digikey.com/product-detail/en/vishay-beyschlag/MCT0603MZ0000ZP500/749-1745-1-ND/7348053; ComponentLink1Description: Digi-Key Link
U4 = FT232RL-REEL: USB Bridge, USB to UART USB 2.0 UART Interface 28-SSOP; Manufacturer: FTDI, Future Technology Devices International Ltd; Value: *; ComponentLink1URL: https://www.digikey.com/product-detail/en/ftdi-future-technology-devices-international-ltd/FT232RL-REEL/768-1007-1-ND/1836402; Digi-Key Part Number: 768-1007-1-ND; ComponentLink1Description: Digi-Key Link; Manufacturer Part Number: FT232RL-REEL

## Sheet Block Diagram.SchDoc: Block Diagram
size A4; Organization: Energy Auditor; Address1: Sensor Node; Address3: University of Colorado; Address4: Boulder; DocumentNumber: 1; Revision: 1; SheetNumber: 1; SheetTotal: 6
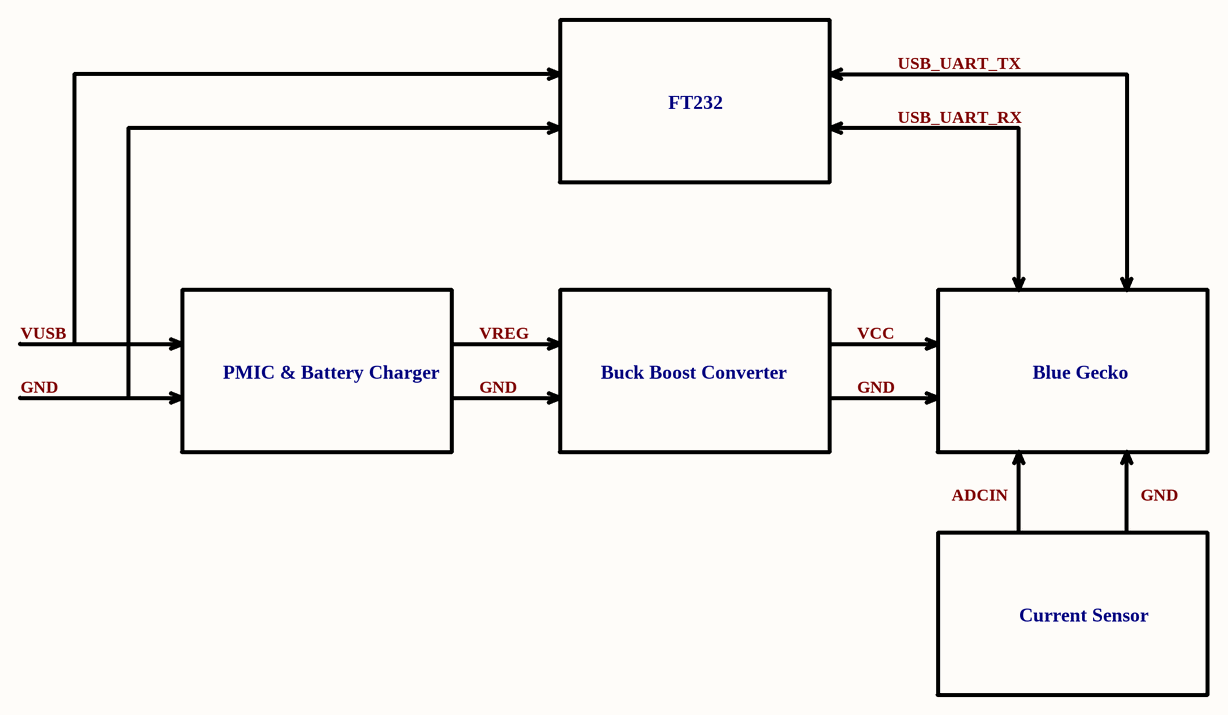
[diagram p5: Block Diagram.SchDoc]

### Notes on the sheet
- FT232
- USB_UART_TX
- USB_UART_RX
- VUSB
- GND
- PMIC & Battery Charger
- VREG
- Buck Boost Converter
- VCC
- Blue Gecko
- ADCIN
- Current Sensor
- Title
- Size:
- Date:
- A4
- Number:
- Time:
- Revision:
- Sheet
- of
- File:

## Nets that join several sheets
GND: PMIC (15 pins), Regulator (14 pins), Gecko (10 pins), Gecko IO (23 pins), USB (6 pins)
DEBUG_GPIO0: Gecko (U3.9), Gecko IO (D9.2 P5.9)
DEBUG_GPIO1: Gecko (U3.10), Gecko IO (D8.2 P5.10)
I2C_SCL: Gecko (U3.18), Gecko IO (D13.2 P5.5)
I2C_SDA: Gecko (U3.19), Gecko IO (D12.2 P5.6)
LED0: Gecko (U3.25), Gecko IO (D6.2)
LED1: Gecko (U3.26), Gecko IO (D7.2)
LEUART_RX: Gecko (U3.3), Gecko IO (D10.2 P5.8)
LEUART_TX: Gecko (U3.2), Gecko IO (D11.2 P5.7)
PB0: Gecko (U3.27), Gecko IO (C9.2 R16.1 S3.1 S3.3)
PB1: Gecko (U3.28), Gecko IO (C10.2 R17.1 S4.1 S4.3)
RESETN: Regulator (R12.1 U2.8), Gecko (U3.30), Gecko IO (5 pins)
SPI_CLK: Gecko (U3.16), Gecko IO (D15.2 P5.3)
SPI_CSN: Gecko (U3.17), Gecko IO (D14.2 P5.4)
SPI_MISO: Gecko (U3.15), Gecko IO (D16.2 P5.2)
SPI_MOSI: Gecko (U3.14), Gecko IO (D17.2 P5.1)
SWCLK: Gecko (U3.21), Gecko IO (D21.2 P4.4)
SWDIO: Gecko (U3.22), Gecko IO (D22.2 P4.2)
SWO: Gecko (U3.23), Gecko IO (D20.2 P4.6)
USB_D+: PMIC (P1.3), USB (U4.15)
USB_D-: PMIC (P1.2), USB (U4.16)
USB_UART_RX: Gecko (U3.13), USB (U4.1)
USB_UART_TX: Gecko (U3.11), USB (U4.5)
V_USB: PMIC (C1.2 R1.2 U1.13), USB (U4.20)
VCC: Regulator (S2.2), Gecko (U3.29), Gecko IO (6 pins)
VREG: PMIC (6 pins), Regulator (C4.2 U2.10 U2.11 U2.12)